# EAGLE design AdafruitHuzzah32Base (EAGLE 9.6.2)
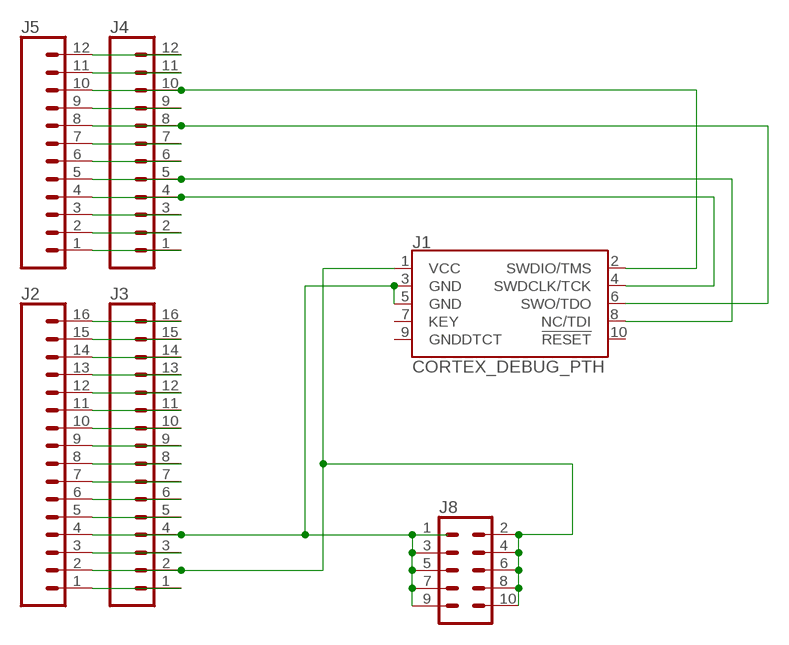
[diagram p0: schematic, sheet 1]

## Parts
J1  CORTEX_DEBUG_PTH  [2X5-PTH-1.27MM]
J2  CONN_16  [1X16]
J3  CONN_16  [1X16]
J4  CONN_12  [1X12]
J5  CONN_12  [1X12]
J8  CONN_05X2PTH  [2X5]

## Nets
N$1: J1.1(VCC) J2.2 J3.2 J8.2 J8.4 J8.6 J8.8 J8.10
N$2: J1.3(GND) J1.5(GND) J2.4 J3.4 J8.1 J8.3 J8.5 J8.7 J8.9
N$3: J1.6(SWO/TDO) J4.8 J5.8
N$4: J1.8(NC/TDI) J4.5 J5.5
N$5: J1.4(SWDCLK/TCK) J4.4 J5.4
N$6: J1.2(SWDIO/TMS) J4.10 J5.10
N$7: J4.12 J5.12
N$8: J4.11 J5.11
N$9: J4.9 J5.9
N$10: J4.7 J5.7
N$11: J4.6 J5.6
N$12: J4.3 J5.3
N$13: J4.2 J5.2
N$14: J4.1 J5.1
N$15: J2.16 J3.16
N$16: J2.15 J3.15
N$17: J2.14 J3.14
N$18: J2.13 J3.13
N$19: J2.12 J3.12
N$20: J2.11 J3.11
N$21: J2.10 J3.10
N$22: J2.9 J3.9
N$23: J2.8 J3.8
N$24: J2.7 J3.7
N$25: J2.6 J3.6
N$26: J2.5 J3.5
N$27: J2.3 J3.3
N$28: J2.1 J3.1
Unconnected: J1.7(KEY) J1.9(GNDDTCT) J1.10(!RESET)

## Library data of the parts
J1 = SparkFun-Connectors:CORTEX_DEBUG: Cortex Debug Connector - 10 pin Supports JTAG debug, Serial Wire debug, and Serial Wire Viewer. PTH and SMD connector options available. General Connector Information <http://infocenter.arm.com/help/topic/com.arm.doc.faqs/attached/13634/cortex_debug_connectors.pdf> Products: PTH Connector <http://www.digikey.com/product-detail/en/cnc-tech/3220-10-0100-00/1175-1627-ND/3883661> -via Digi-Key SparkFun PSoc <https://www.sparkfun.com/products/13229> SparkFun T <https://www.sparkfun.com/products/13810>
J2 J3 = SparkFun-Connectors:CONN_16: Multi connection point. Often used as Generic Header-pin footprint for 0.1 inch spaced/style header connections On any of the 0.1 inch spaced packages, you can populate with these: Break Away Headers - Straight <https://www.sparkfun.com/products/116> (PRT-00116) Break Away Male Headers - Right Angle <https://www.sparkfun.com/products/553> (PRT-00553) Female Headers <https://www.sparkfun.com/products/115> (PRT-00115) Break Away Headers - Machine Pin <https://www.sparkfun.com/products/117> (PRT-00117) Break Away Female Headers - Swiss Machine Pin <https://www.sparkfun.com/products/743> (PRT-00743) For SCREWTERMINALS and SPRING TERMINALS visit here: Screw Terimnals on SparkFun.com <https://www.sparkfun.com/search/results?term=Screw+Terminals> (5mm/3.5mm/2.54mm spacing) This device is also useful as a general connection point to wire up your design to another part of your project. Our various solder wires solder well into these plated through hole pads. Hook-Up Wire - Assortment (Stranded, 22 AWG) <https://www.sparkfun.com/products/11375> (PRT-11375) Hook-Up Wire - Assortment (Solid Core, 22 AWG) <https://www.sparkfun.com/products/11367> (PRT-11367) View the entire wire category on our website here <https://www.sparkfun.com/categories/141> Special notes: Molex polarized connector foot print use with SKU : PRT-08231 with associated crimp pins and housings. 1MM SMD Version SKU: PRT-10208 NOTES ON THE VARIANTS LOCK and LOCK_LONGPADS... This footprint was designed to help hold the alignment of a through-hole component (i.e. 6-pin header) while soldering it into place. You may notice that each hole has been shifted either up or down by 0.005 of an inch from it's more standard position (which is a perfectly straight line). This slight alteration caused the pins (the squares in the middle) to touch the edges of the holes. Because they are alternating, it causes a "brace" to hold the component in place. 0.005 has proven to be the perfect amount of "off-center" position when using our standard breakaway headers. Although looks a little odd when you look at the bare footprint, once you have a header in there, the alteration is very hard to notice. Also,if you push a header all the way into place, it is covered up entirely on the bottom side.
J4 J5 = SparkFun-Connectors:CONN_12: Multi connection point. Often used as Generic Header-pin footprint for 0.1 inch spaced/style header connections On any of the 0.1 inch spaced packages, you can populate with these: Break Away Headers - Straight <https://www.sparkfun.com/products/116> (PRT-00116) Break Away Male Headers - Right Angle <https://www.sparkfun.com/products/553> (PRT-00553) Female Headers <https://www.sparkfun.com/products/115> (PRT-00115) Break Away Headers - Machine Pin <https://www.sparkfun.com/products/117> (PRT-00117) Break Away Female Headers - Swiss Machine Pin <https://www.sparkfun.com/products/743> (PRT-00743) For SCREWTERMINALS and SPRING TERMINALS visit here: Screw Terimnals on SparkFun.com <https://www.sparkfun.com/search/results?term=Screw+Terminals> (5mm/3.5mm/2.54mm spacing) This device is also useful as a general connection point to wire up your design to another part of your project. Our various solder wires solder well into these plated through hole pads. Hook-Up Wire - Assortment (Stranded, 22 AWG) <https://www.sparkfun.com/products/11375> (PRT-11375) Hook-Up Wire - Assortment (Solid Core, 22 AWG) <https://www.sparkfun.com/products/11367> (PRT-11367) View the entire wire category on our website here <https://www.sparkfun.com/categories/141> Special notes: Molex polarized connector foot print use with SKU : PRT-08231 with associated crimp pins and housings. 1MM SMD Version SKU: PRT-10208 NOTES ON THE VARIANTS LOCK and LOCK_LONGPADS... This footprint was designed to help hold the alignment of a through-hole component (i.e. 6-pin header) while soldering it into place. You may notice that each hole has been shifted either up or down by 0.005 of an inch from it's more standard position (which is a perfectly straight line). This slight alteration caused the pins (the squares in the middle) to touch the edges of the holes. Because they are alternating, it causes a "brace" to hold the component in place. 0.005 has proven to be the perfect amount of "off-center" position when using our standard breakaway headers. Although looks a little odd when you look at the bare footprint, once you have a header in there, the alteration is very hard to notice. Also,if you push a header all the way into place, it is covered up entirely on the bottom side.
J8 = SparkFun-Connectors:CONN_05X2: Multi connection point. Often used as Generic Header-pin footprint for 0.1 inch spaced/style header connections For AVR SPI programming port, see special device with nice symbol: "AVR_SPI_PROG_5x2.dev" You can populate with any combo of single row headers, but if you'd like an exact match, check these: 2x5 AVR ICSP Male Header <https://www.sparkfun.com/products/778> (PRT-00778) 2x5 Pin Shrouded Header <https://www.sparkfun.com/products/8506> (PRT-08506) On any of the 0.1 inch spaced packages, you can populate with these: Break Away Headers - Straight <https://www.sparkfun.com/products/116> (PRT-00116) Break Away Male Headers - Right Angle <https://www.sparkfun.com/products/553> (PRT-00553) Female Headers <https://www.sparkfun.com/products/115> (PRT-00115) Break Away Headers - Machine Pin <https://www.sparkfun.com/products/117> (PRT-00117) Break Away Female Headers - Swiss Machine Pin <https://www.sparkfun.com/products/743> (PRT-00743) Special note: the shrouded connector mates well with our 5x2 ribbon cables: 2x5 Pin IDC Ribbon Cable <https://www.sparkfun.com/products/8535> (PRT-08535); PROD_ID: CONN-08499; SF_ID: PRT-0778

## Board
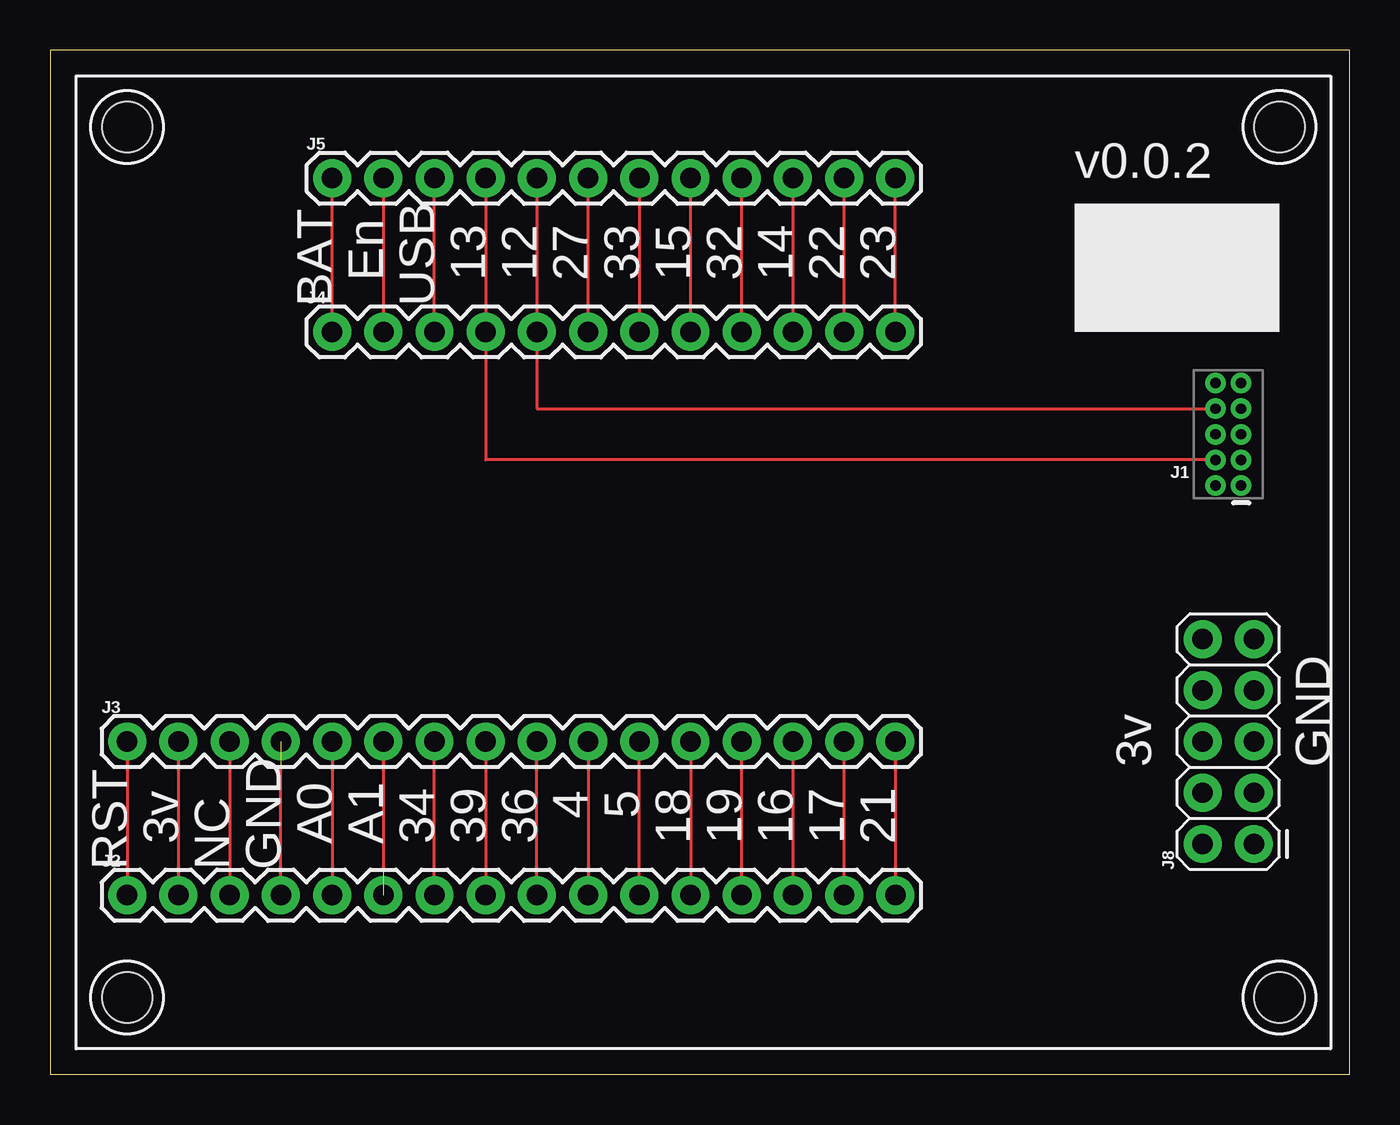
[diagram p1: board, top side]
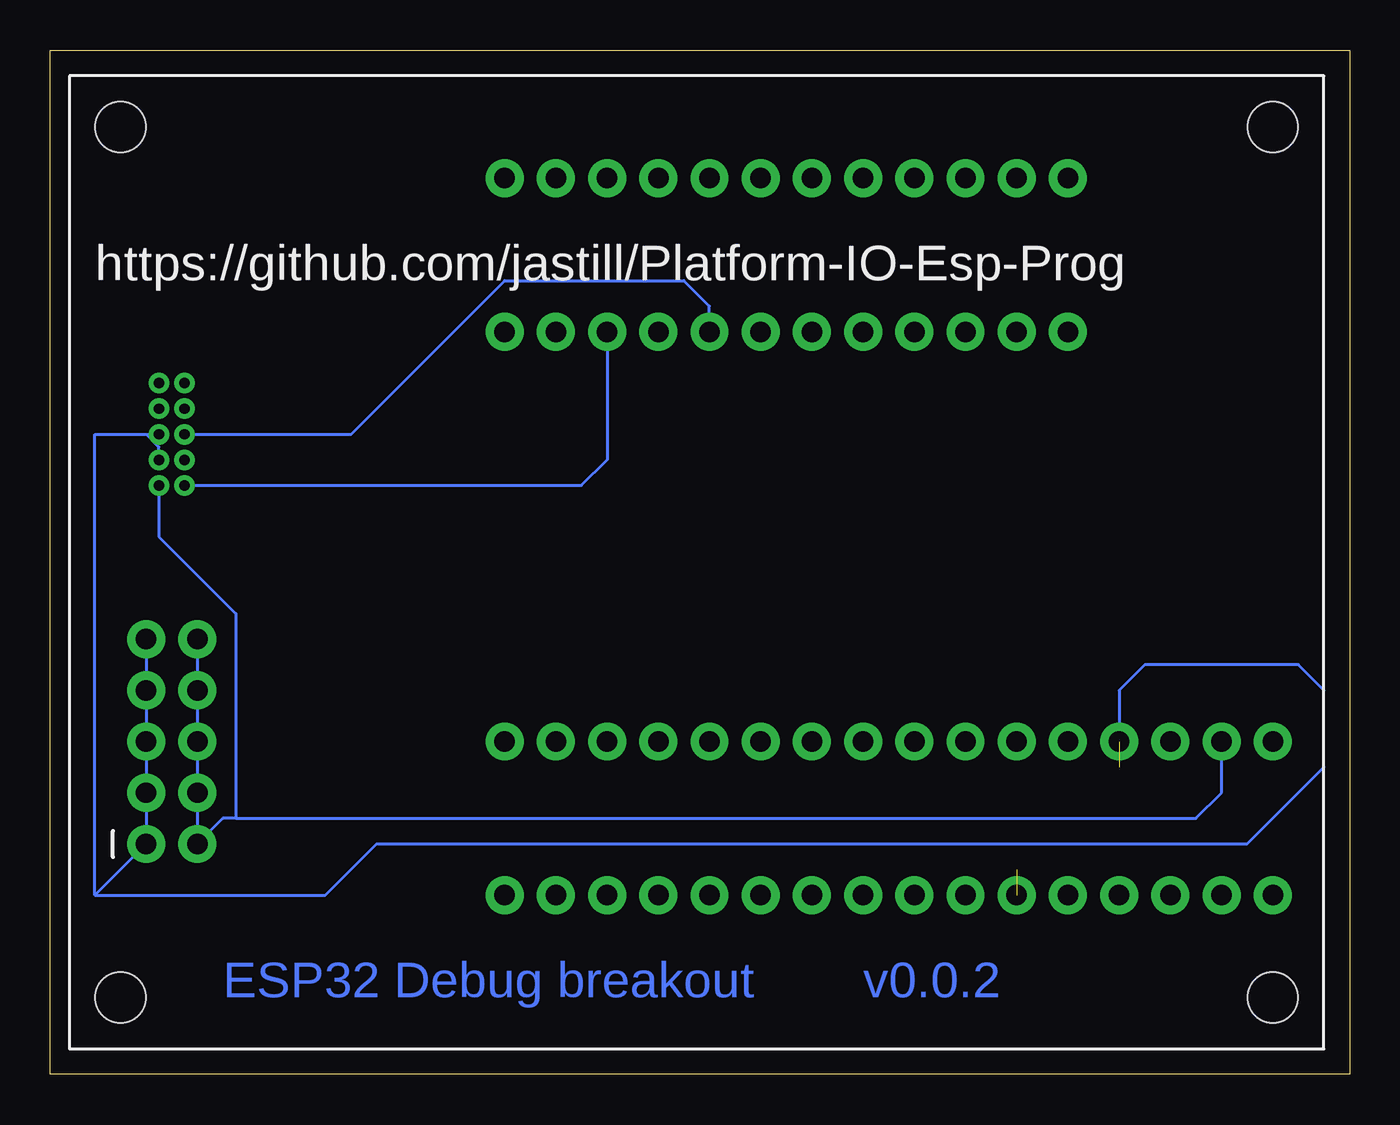
[diagram p2: board, bottom side, seen from below]

Size 64.44 x 50.79 mm. Coordinates in mm from the lower left corner, seen from the top.
Outline: 0,0 64.44,0 64.44,50.79 0,50.79 0,0
Copper layers (1*16): Top 0.035mm / dielectric 1.5mm / Bottom 0.035mm
Design rules "default": minimum track width 6mil, minimum drill 0.35mm, track to track 6mil, track to pad 6mil, pad to pad 6mil, via to via 6mil, smd to smd 6mil, copper to edge 40mil, drill to drill 6mil, minimum pad ring 10mil, minimum via ring 8mil, stop-mask expansion 4mil, vias tented up to drill 0mil, thermal gap 10mil
Holes 2.5 mm at 60.96,46.99 60.96,3.81 3.81,3.81 3.81,46.99

### Footprints (pad centres in the part's own frame; a part is rotated, then mirrored left to right if it is on the bottom)
2X5-PTH-1.27MM = drill 0.508 pad 1: 1 -2.54,-0.635; 2 -2.54,0.635; 3 -1.27,-0.635; 4 -1.27,0.635; 5 0,-0.635; 6 0,0.635; 7 1.27,-0.635; 8 1.27,0.635; 9 2.54,-0.635; 10 2.54,0.635
1X16 = drill 1.016 pad 1.88: 1 0,0; 2 2.54,0; 3 5.08,0; 4 7.62,0; 5 10.16,0; 6 12.7,0; 7 15.24,0; 8 17.78,0; 9 20.32,0; 10 22.86,0; 11 25.4,0; 12 27.94,0; 13 30.48,0; 14 33.02,0; 15 35.56,0; 16 38.1,0
1X12 = drill 1.016 pad 1.88: 1 0,0; 2 2.54,0; 3 5.08,0; 4 7.62,0; 5 10.16,0; 6 12.7,0; 7 15.24,0; 8 17.78,0; 9 20.32,0; 10 22.86,0; 11 25.4,0; 12 27.94,0
2X5 = drill 1.016 pad 1.88: 1 0,0; 2 0,2.54; 3 2.54,0; 4 2.54,2.54; 5 5.08,0; 6 5.08,2.54; 7 7.62,0; 8 7.62,2.54; 9 10.16,0; 10 10.16,2.54

### Placement (x,y rotation side)
J1  58.42,31.75 90 top
J2  3.81,8.89 0 top
J3  3.81,16.51 0 top
J4  13.97,36.83 0 top
J5  13.97,44.45 0 top
J8  59.69,11.43 90 top

### Tracks (layer width: path | path; a pad name or v marks a point on that pad's centre or on a via)
N$1
  Top 0.152: J3.2 J2.2
  Bottom 0.152: J1.1 59.05,26.67 55.24,22.86 55.24,12.7 | 55.24,12.7 55.88,12.7 J8.2 J8.4 J8.6 J8.8 J8.10 56.52,21.59 | 55.24,12.7 53.34,12.7 7.62,12.7 6.35,13.97 J3.2
N$2  (1 unrouted)
  Top 0.152: J2.4 11.43,15.24
  Bottom 0.152: 62.23,8.89 50.8,8.89 48.26,11.43 5.08,11.43 1.27,15.24 1.27,19.05 2.54,20.32 10.16,20.32 11.43,19.05 J3.4 | 59.69,31.75 62.23,31.75 62.23,8.89 | 59.69,31.75 J1.5 | J1.3 59.05,31.12 59.69,31.75 | 62.23,8.89 J8.1 J8.3 J8.5 J8.7 J8.9
N$3
  Top 0.152: J4.8 J5.8
  Bottom 0.152: J1.6 49.53,31.75 41.91,39.37 33.02,39.37 31.75,38.1 J4.8
N$4
  Top 0.152: J1.8 24.13,33.02 J4.5 J5.5
N$5
  Top 0.152: J1.4 21.59,30.48 J4.4 J5.4
N$6
  Top 0.152: J5.10 J4.10
  Bottom 0.152: J1.2 38.1,29.21 36.83,30.48 J4.10
N$7
  Top 0.152: J4.12 J5.12
N$8
  Top 0.152: J4.11 J5.11
N$9
  Top 0.152: J4.9 J5.9
N$10
  Top 0.152: J5.7 J4.7
N$11
  Top 0.152: J4.6 J5.6
N$12
  Top 0.152: J4.3 J5.3
N$13
  Top 0.152: J5.2 J4.2
N$14
  Top 0.152: J4.1 J5.1
N$15
  Top 0.152: J3.16 J2.16
N$16
  Top 0.152: J2.15 J3.15
N$17
  Top 0.152: J3.14 J2.14
N$18
  Top 0.152: J2.13 J3.13
N$19
  Top 0.152: J3.12 J2.12
N$20
  Top 0.152: J2.11 J3.11
N$21
  Top 0.152: J3.10 J2.10
N$22
  Top 0.152: J2.9 J3.9
N$23
  Top 0.152: J3.8 J2.8
N$24
  Top 0.152: J2.7 J3.7
N$25  (1 unrouted)
  Top 0.152: J3.6 16.51,10.16
N$26
  Top 0.152: J3.5 J2.5
N$27
  Top 0.152: J3.3 J2.3
N$28
  Top 0.152: J3.1 J2.1

### Text on the board
Bottom: v0.0.2 | ESP32 Debug breakout
tPlace: v0.0.2 | En | 13 | 12 | 27 | 33 | 15 | 32 | 14 | 22 | 23 | BAT | USB | 4 | 5 | 3v | A0 | A1 | 34 | 39 | 36 | 18 | 19 | 16 | 17 | 21 | RST | NC | GND
tNames: 3v | GND
bNames: https://github.com/jastill/Platform-IO-Esp-Prog